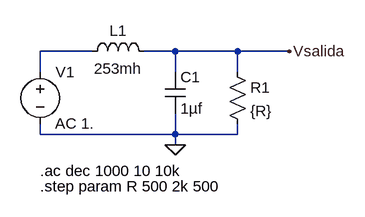
[diagram p0: schematic TP 3 Analisis de alterna 2.asc]
TP 3 Analisis de alterna 2.asc, the LTspice schematic file:
Version 4
SHEET 1 880 680
WIRE 128 128 48 128
WIRE 256 128 208 128
WIRE 352 128 256 128
WIRE 432 128 352 128
WIRE 48 160 48 128
WIRE 256 160 256 128
WIRE 352 160 352 128
WIRE 48 256 48 240
WIRE 256 256 256 224
WIRE 256 256 48 256
WIRE 352 256 352 240
WIRE 352 256 256 256
WIRE 256 272 256 256
FLAG 256 272 0
FLAG 432 128 Vsalida
SYMBOL ind 112 144 R270
WINDOW 0 32 56 VTop 2
WINDOW 3 5 56 VBottom 2
SYMATTR InstName L1
SYMATTR Value 253mh
SYMBOL cap 240 160 R0
SYMATTR InstName C1
SYMATTR Value 1µf
SYMBOL res 336 144 R0
SYMATTR InstName R1
SYMATTR Value {R}
SYMBOL voltage 48 144 R0
WINDOW 123 23 95 Left 2
WINDOW 39 0 0 Left 0
SYMATTR Value2 AC 1.
SYMATTR InstName V1
SYMATTR Value ""
TEXT 48 312 Left 2 !.ac dec 1000 10 10k
TEXT 48 336 Left 2 !.step param R 500 2k 500

The netlist it stands for:
* TP 3 Analisis de alterna 2.asc
L1 N001 Vsalida 253mh
C1 Vsalida 0 1µf
R1 Vsalida 0 {R}
V1 N001 0 AC 1.
.ac dec 1000 10 10k
.step param R 500 2k 500
.backanno
.end